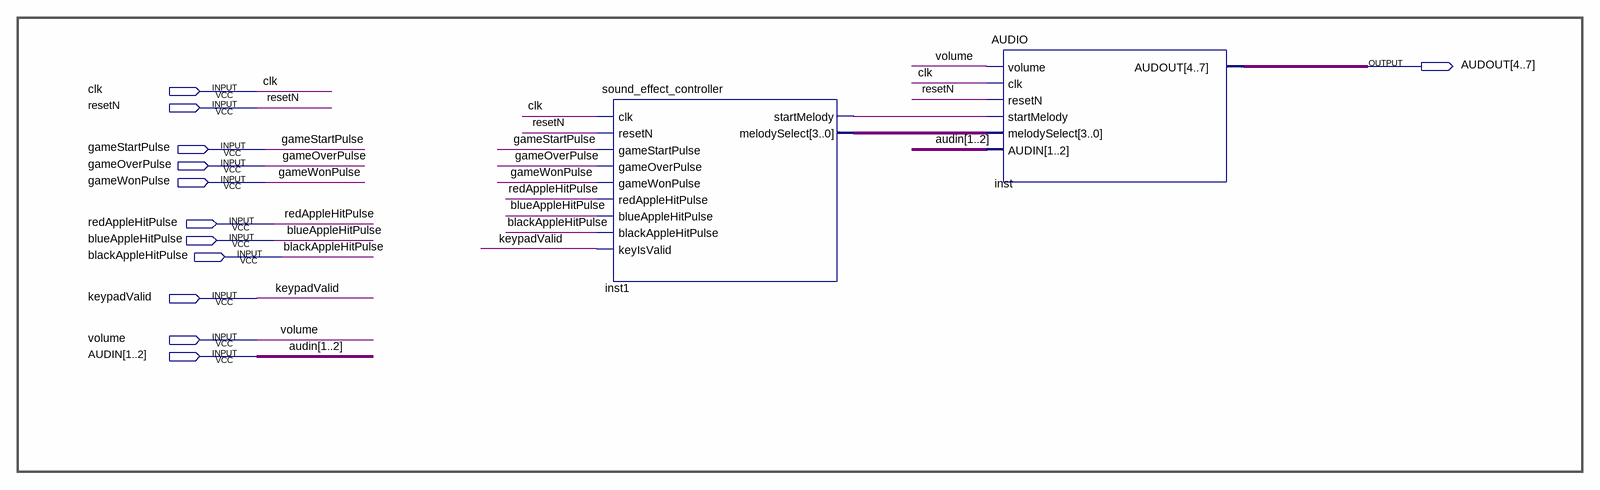
[diagram p0: schematic sheet]
// Quartus schematic Audio_Block.bdf as structural Verilog: 2 symbols, 12 pins
module Audio_Block (
  input  clk,
  input  resetN,
  input  gameStartPulse,
  input  gameOverPulse,
  input  gameWonPulse,
  input  redAppleHitPulse,
  input  blueAppleHitPulse,
  input  blackAppleHitPulse,
  input  keypadValid,
  input  volume,
  input  [1:2] AUDIN,
  output [4:7] AUDOUT
);

  wire inst1_startmelody;
  wire [3:0] inst1_melodyselect;

  sound_effect_controller inst1 (
    .clk(clk), .resetN(resetN), .gameStartPulse(gameStartPulse), .gameOverPulse(gameOverPulse),
    .gameWonPulse(gameWonPulse), .redAppleHitPulse(redAppleHitPulse), .blueAppleHitPulse(blueAppleHitPulse),
    .blackAppleHitPulse(blackAppleHitPulse), .keyIsValid(keypadValid), .startMelody(inst1_startmelody),
    .melodySelect(inst1_melodyselect));
  AUDIO inst (
    .volume(volume), .clk(clk), .resetN(resetN), .startMelody(inst1_startmelody),
    .melodySelect(inst1_melodyselect), .AUDIN(AUDIN), .AUDOUT(AUDOUT));
endmodule
